# Altium schematic sheet NRF&Gyro.SchDoc
size A
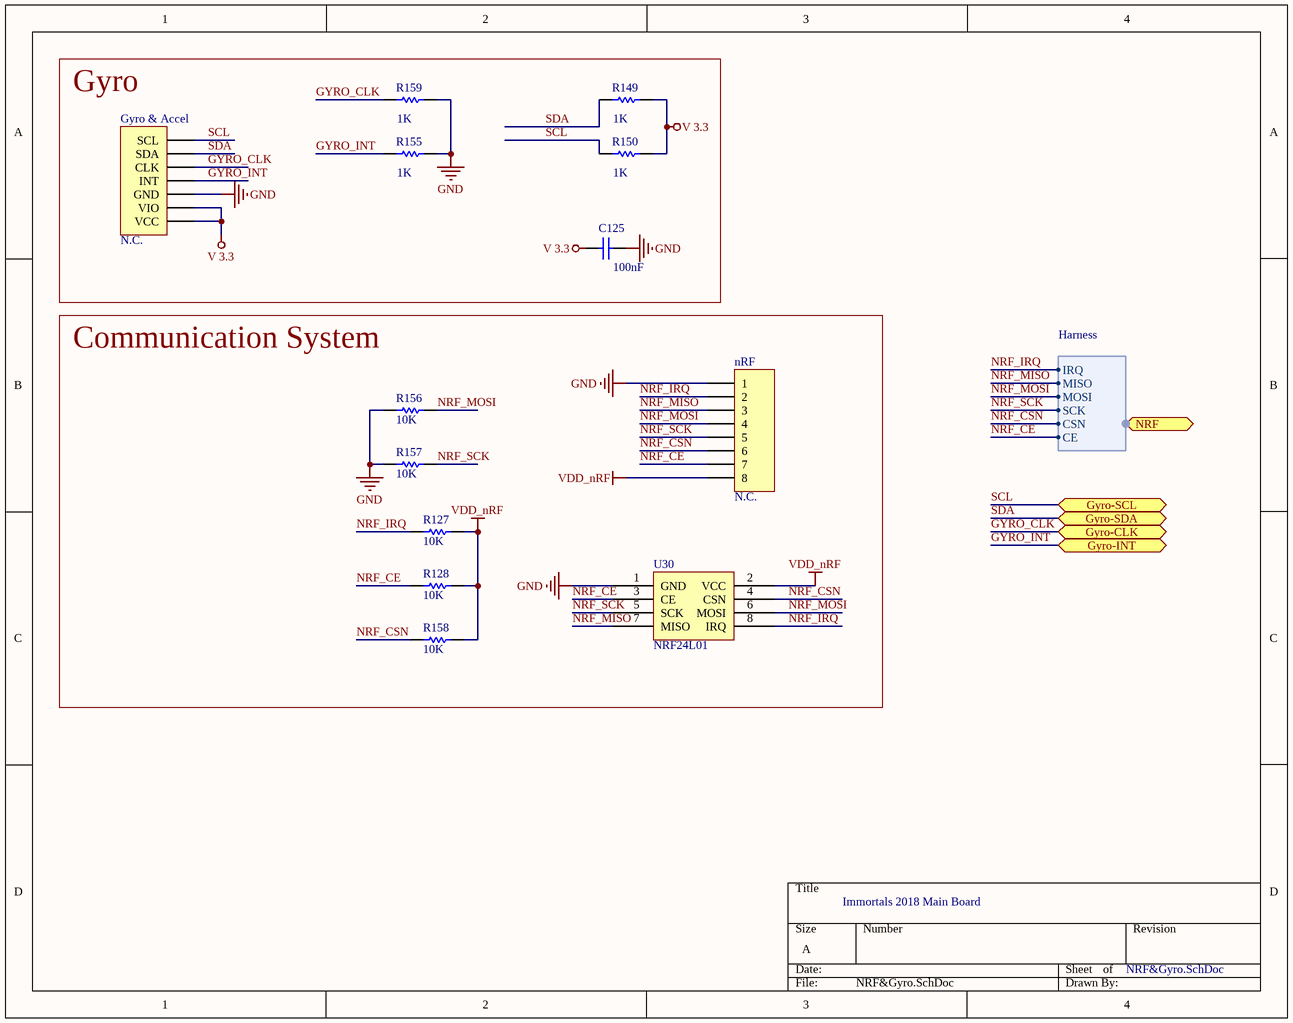
[diagram p0: NRF&Gyro.SchDoc]

## Parts
C125  value 100nF  [C1206]  (hidden comment: Cap 100nF 1206)
Gyro_&_Accel  N.C.  [Gyro_7pin]
nRF  N.C.  [HDR1X8]
R127  value 10K  [1608[0603]]  (hidden comment: Res 10K 0603)
R128  value 10K  [1608[0603]]  (hidden comment: Res 10K 0603)
R149  value 1K  [1608[0603]]  (hidden comment: Res 1K 0603)
R150  value 1K  [1608[0603]]  (hidden comment: Res 1K 0603)
R155  value 1K  [1608[0603]]  (hidden comment: Res 1K 0603)
R156  value 10K  [1608[0603]]  (hidden comment: Res 10K 0603)
R157  value 10K  [1608[0603]]  (hidden comment: Res 10K 0603)
R158  value 10K  [1608[0603]]  (hidden comment: Res 10K 0603)
R159  value 1K  [1608[0603]]  (hidden comment: Res 1K 0603)
U30  NRF24L01  [NRF24L01]

## Blocks framed on the sheet
Gyro: C125 Gyro_&_Accel R149 R150 R155 R159
Communication System: nRF R127 R128 R156-R158 U30

## Ports
Gyro-CLK, Gyro-INT, Gyro-SCL, Gyro-SDA, NRF (harness Harness)

## Harnesses
Harness: IRQ, MISO, MOSI, SCK, CSN, CE

## Nets
GND: C125.2 Gyro_&_Accel.5(GND) nRF.1 R155.2 R156.2 R157.2 R159.2 U30.1(GND)
V 3.3: C125.1 Gyro_&_Accel.6(VIO) Gyro_&_Accel.7(VCC) R149.1 R150.1
VDD_nRF: nRF.8 R127.1 R128.1 R158.1 U30.2(VCC)
GYRO_CLK: Gyro_&_Accel.3(CLK) R159.1 ; port Gyro-CLK
GYRO_INT: Gyro_&_Accel.4(INT) R155.1 ; port Gyro-INT
NRF_CE: nRF.7 R128.2 U30.3(CE) ; port NRF.CE
NRF_CSN: nRF.6 R158.2 U30.4(CSN) ; port NRF.CSN
NRF_IRQ: nRF.2 R127.2 U30.8(IRQ) ; port NRF.IRQ
NRF_MISO: nRF.3 U30.7(MISO) ; port NRF.MISO
NRF_MOSI: nRF.4 R156.1 U30.6(MOSI) ; port NRF.MOSI
NRF_SCK: nRF.5 R157.1 U30.5(SCK) ; port NRF.SCK
SCL: Gyro_&_Accel.1(SCL) R150.2 ; port Gyro-SCL
SDA: Gyro_&_Accel.2(SDA) R149.2 ; port Gyro-SDA

## Notes on the sheet
- Immortals 2018 Main Board

## Library data of the parts
C125 = CAP: Capacitor; Fitted: True
Gyro_&_Accel = Gyroscope: Comp & Gyro
nRF = Header 8: Header, 8-Pin; LatestRevisionDate: 17-Jul-2002; LatestRevisionNote: Re-released for DXP Platform.; Publisher: Altium Limited
R127 R128 R149 R150 R155-R159 = Res Semi: Semiconductor Resistor; Published: 8-Jun-2000; LatestRevisionDate: 17-Jul-2002; LatestRevisionNote: Re-released for DXP Platform.; PackageReference: AXIAL-0.5; Publisher: Altium Limited